# Altium schematic sheet SME_tps63021.SchDoc: Titulo
size OrCAD A; Author: Ismael Poblete V.; CompanyName: SME; Organization: SME; Address1: Santiago, Chile; DocumentNumber: SME-UNO; Revision: 1.0; SheetNumber: 3; SheetTotal: 7
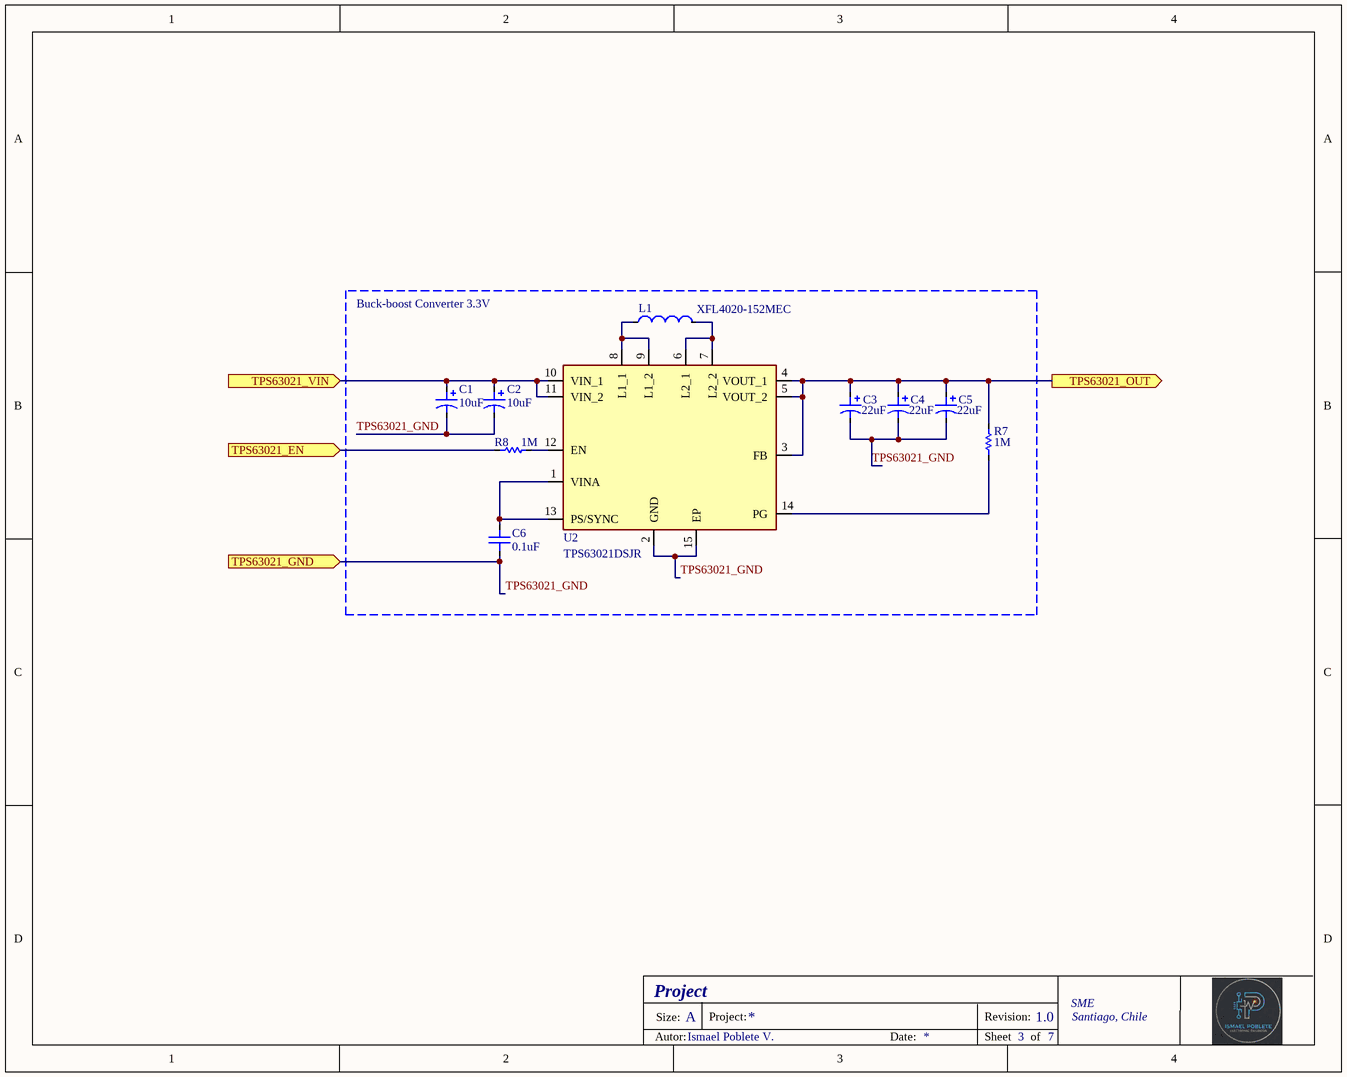
[diagram p0: SME_tps63021.SchDoc]

## Parts
C1  Capacitance: 10uF  [CASE_A]  (hidden comment: T491A106M016AT)
C2  Capacitance: 10uF  [CASE_A]  (hidden comment: T491A106M016AT)
C3  Capacitance: 22uF  [T491B / CASE_B]  (hidden comment: T491B226K006AT)
C4  Capacitance: 22uF  [T491B / CASE_B]  (hidden comment: T491B226K006AT)
C5  Capacitance: 22uF  [T491B / CASE_B]  (hidden comment: T491B226K006AT)
C6  Capacitance: 0.1uF  [C0603]  (hidden comment: CC0603KRX7R9BB104)
L1  XFL4020-152MEC  [XFL4020152MEC]
R7  Resistance: 1M  [RES_0603]  (hidden comment: RT0603FRE071ML)
R8  Resistance: 1M  [RES_0603]  (hidden comment: RT0603FRE071ML)
U2  TPS63021DSJR  [VSON-14]

## Blocks framed on the sheet
Buck-boost Converter 3.3V: C1-C6 L1 R7 R8 U2

## Ports
TPS63021_EN (in, see SME_Main[3B]), TPS63021_GND (in, see SME_Main[4B]), TPS63021_OUT (out, see SME_Main[4B]), TPS63021_VIN (in, see SME_Main[3B])

## Nets
TPS63021_EN: R8.1 ; port TPS63021_EN
TPS63021_GND: C1.2 C2.2 C3.2 C4.2 C5.2 C6.1 U2.2(GND) U2.15(EP) ; port TPS63021_GND
TPS63021_OUT: C3.1 C4.1 C5.1 R7.2 U2.3(FB) U2.4(VOUT_1) U2.5(VOUT_2) ; port TPS63021_OUT
TPS63021_VIN: C1.1 C2.1 U2.10(VIN_1) U2.11(VIN_2) ; port TPS63021_VIN
NetC6_2: C6.2 U2.1(VINA) U2.13(PS/SYNC)
NetL1_1: L1.1 U2.8(L1_1) U2.9(L1_2)
NetL1_2: L1.2 U2.6(L2_1) U2.7(L2_2)
NetR7_1: R7.1 U2.14(PG)
NetR8_2: R8.2 U2.12(EN)

## Notes on the sheet
- Project
- Size:
- A
- Project:
- Revision:
- Autor:
- Date:
- Sheet
- of

## Library data of the parts
C1 C2 = T491A106M016AT: KEMET - T491A106M016AT - Surface Mount Tantalum Capacitor, 10 µF, 16 V, 1206 [3216 Metric], T491 Series, ± 20%, -55 °C; Manufacturer: Yageo Group; Material: Ceramic; Tolerance: 10%; Dielectric: X5R; Voltage Rating (DC): 10V; ESR (Equivalent Series Resistance): 7R; Life (Hours): 2000Hour; Dissipation Factor: 8%; Leakage Current: 1.6uA; Polarity: Polar; Ripple Current: 104mA; Voltage: 16V; Type: SMD; Supplier 1: Digi-Key; Supplier Part Number 1: 1276-1192-1-ND; Manufacturer Part Number: T491A106M016AT; RoHS: Yes; Category: Ceramic Capacitors; Stock 1: 1573745; Pricing 1: 1=0.19000, 10=0.13200, 50=0.07940, 100=0.06700, 500=0.04588, 1000=0.04058 (USD); Mount: Surface Mount; Case/Package: 0603; Case Code (Metric): 1608; Case Code (Imperial): 0603; Contact Plating: Tin; Min Operating Temperature: -55°C; Max Operating Temperature: 85°C; Package Quantity: 1; Packaging: Tape and Reel; Voltage Rating: 10V; Length: 1.6mm; Height: 0.8mm; Thickness: 0.035inch; Depth: 0.8mm; Width: 0.031inch; Radiation Hardening: No; Lead Free: Lead Free; ComponentLink1URL: https://datasheet.ciiva.com/26877/getdatasheetpartid-359551-26877881.pdf?src-supplier=Verical; ComponentLink1Description: https://datasheet.ciiva.com/26877/getdatasheetpartid-359551-26877881.pdf?src-supplier=Verical; ComponentLink2URL: https://datasheet.ciiva.com/29198/457369-da-01-en-vs-kondensator-0603-29198790.pdf?src-supplier=Conrad; ComponentLink2Description: https://datasheet.ciiva.com/29198/457369-da-01-en-vs-kondensator-0603-29198790.pdf?src-supplier=Conrad; ComponentLink3URL: https://datasheet.ciiva.com/16200/cl05b104kq5nnnc-16200766.pdf?src-supplier=Future+Electronics; ComponentLink3Description: https://datasheet.ciiva.com/16200/cl05b104kq5nnnc-16200766.pdf?src-supplier=Future+Electronics; Supplier 2: Digi-Key; Supplier Part Number 2: 399-3687-1-ND; Stock 2: 249031; Pricing 2: 1=0.43000, 10=0.29900, 50=0.20940, 100=0.17950, 500=0.13464, 1000=0.11370 (USD); Dielectric Material: Tantalum; Features: General Purpose; Termination: SMD/SMT; Height - Seated (Max): 0.071inch; Lead Pitch: 1.2mm; REACH SVHC: No SVHC; ComponentLink4URL: https://datasheet.ciiva.com/27092/1573281-27092884.pdf?src-supplier=Jameco; ComponentLink4Description: https://datasheet.ciiva.com/27092/1573281-27092884.pdf?src-supplier=Jameco; ComponentLink5URL: https://datasheet.ciiva.com/7696/1732759-7696297.pdf?src-supplier=Element14; ComponentLink5Description: https://datasheet.ciiva.com/7696/1732759-7696297.pdf?src-supplier=Element14; ComponentLink6URL: https://datasheet.ciiva.com/7696/1854511-7696298.pdf?src-supplier=Element14; ComponentLink6Description: https://datasheet.ciiva.com/7696/1854511-7696298.pdf?src-supplier=Element14; ComponentLink7URL: https://datasheet.ciiva.com/257/kem-t2005-t491-257611.pdf?src-supplier=Digi-Key; ComponentLink7Description: https://datasheet.ciiva.com/257/kem-t2005-t491-257611.pdf?src-supplier=Digi-Key; ComponentLink8URL: https://datasheet.ciiva.com/5934/kem-t2005-t491-5934795.pdf?src-supplier=Farnell; ComponentLink8Description: https://datasheet.ciiva.com/5934/kem-t2005-t491-5934795.pdf?src-supplier=Farnell; ComponentLink9URL: https://datasheet.ciiva.com/257/kem-t2005-t491-257612.pdf?src-supplier=Digi-Key; ComponentLink9Description: https://datasheet.ciiva.com/257/kem-t2005-t491-257612.pdf?src-supplier=Digi-Key; ComponentLink10URL: https://datasheet.ciiva.com/257/kem-t2005-t491-257613.pdf?src-supplier=Digi-Key; ComponentLink10Description: https://datasheet.ciiva.com/257/kem-t2005-t491-257613.pdf?src-supplier=Digi-Key; ComponentLink11URL: https://datasheet.ciiva.com/12883/kem-t2005-t491-12883118.pdf?src-supplier=Mouser; ComponentLink11Description: https://datasheet.ciiva.com/12883/kem-t2005-t491-12883118.pdf?src-supplier=Mouser; ComponentLink12URL: https://datasheet.ciiva.com/14589/70095774-14589054.pdf?src-supplier=Allied+Electronics; ComponentLink12Description: https://datasheet.ciiva.com/14589/70095774-14589054.pdf?src-supplier=Allied+Electronics; ComponentLink13URL: https://datasheet.ciiva.com/14597/70095774-14597406.pdf?src-supplier=Allied+Electronics; ComponentLink13Description: https://datasheet.ciiva.com/14597/70095774-14597406.pdf?src-supplier=Allied+Electronics; Package: A Case
C3-C5 = T491B226K006AT: Tantalum Capacitors - Solid SMD 6.3V 22uF 1311 10% ESR=3.5ohms; Manufacturer: Yageo Group; Package: B Case; Type: SMD; Manufacturer Part Number: T491B226K006AT
C6 = CC0603KRX7R9BB104: Multilayer Ceramic Capacitors MLCC - SMD/SMT 50 V 0.1uF X7R 0603 10%; Manufacturer: Yageo Group; Type: SMD; Package: 0603; Manufacturer Part Number: CC0603KRX7R9BB104
L1 = XFL4020-152MEC: COILCRAFT - XFL4020-152MEC - Power Inductor (SMD), 1.5 H, 9.1 A, Shielded, 4.1 A, XFL4020; Geometry.Height: 2.1mm; Mouser Part Number: 994-XFL4020-152MEC; Mouser Price/Stock: https://www.mouser.co.uk/ProductDetail/Coilcraft/XFL4020-152MEC?qs=zCSbvcPd3pak5QYA2uujRA%3D%3D; Manufacturer_Name: COILCRAFT; Manufacturer_Part_Number: XFL4020-152MEC; Datasheet Link: https://www.coilcraft.com/getmedia/50632d43-da1b-4cdb-8ab4-3029cab51df3/xfl4020.pdf; Manufacturer: Coilcraft; Package: 1616; Type: SMD; Manufacturer Part Number: XFL4020-152MEC
R7 R8 = RT0603FRE071ML: Thin Film Resistors - SMD 1M OHM 1% 50PPM 1/10 W; Manufacturer: Yageo Group; Case/Package: 0603; Package: 0603; Type: SMD; Manufacturer Part Number: RT0603FRE071ML
U2 = TPS63021DSJR: High Efficiency Single Inductor Buck-Boost Converter with 4A Switch; Manufacturer_Name: Texas Instruments; Geometry.Height: 1mm; Mouser Part Number: 595-TPS63021DSJR; Mouser Price/Stock: https://www.mouser.co.uk/ProductDetail/Texas-Instruments/TPS63021DSJR?qs=C44r%252BX3hXgL5uT9uesn8fg%3D%3D; Manufacturer_Part_Number: TPS63021DSJR; Datasheet Link: http://www.ti.com/lit/gpn/tps63021; Manufacturer: Texas Instruments; Package: VSON-14; Type: SMD; Manufacturer Part Number: TPS63021DSJR